# Altium schematic sheet Modes.SchDoc
size A3; SheetNumber: 2; SheetTotal: 6
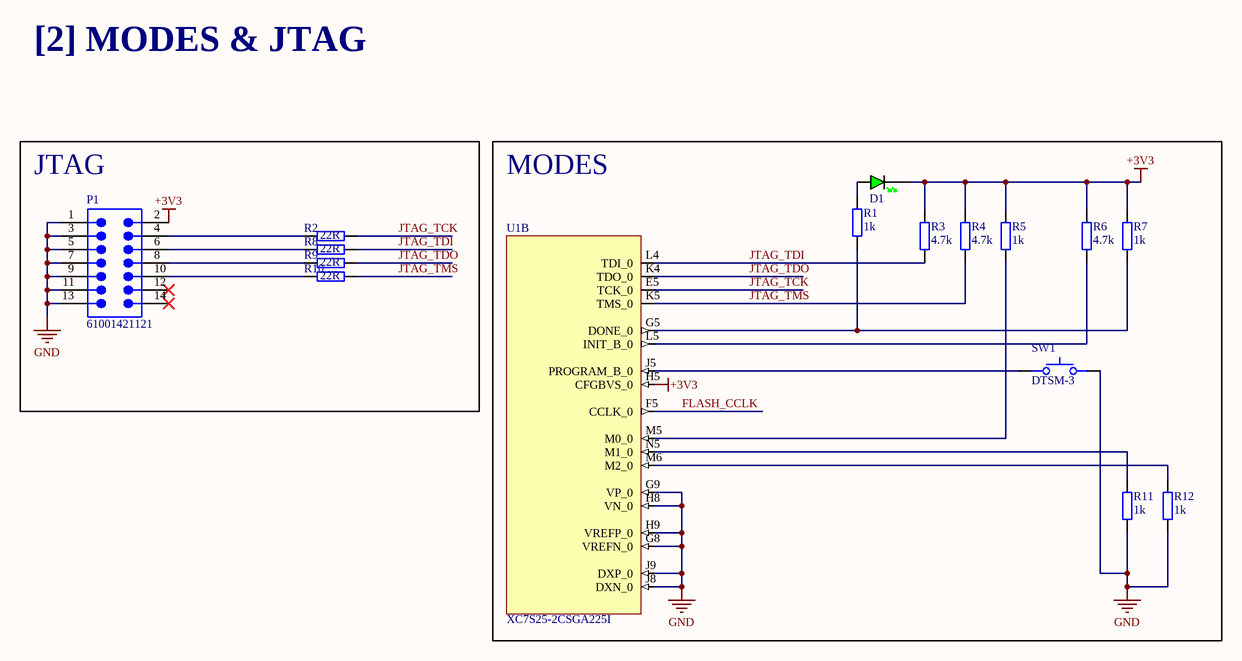
[diagram p0: Modes.SchDoc]

## Parts
D1  GREEN  [LED_0402_GREEN]  (value not drawn)
P1  61001421121  [61001421121]
R1  1k  [RES_0402]
R2  22R  [RES_0402]
R3  4.7k  [RES_0402]
R4  4.7k  [RES_0402]
R5  1k  [RES_0201]
R6  4.7k  [RES_0402]
R7  1k  [RES_0402]
R8  22R  [RES_0402]
R9  22R  [RES_0402]
R10  22R  [RES_0402]
R11  1k  [RES_0201]
R12  1k  [RES_0201]
SW1  DTSM-3  [DTSM-3]
U1  XC7S25-2CSGA225I  [CSGA225]  (part B of 5)

## Blocks framed on the sheet
JTAG: P1 R2 R8-R10
MODES: D1 R1 R3-R7 R11 R12 SW1 U1

## Nets
+3V3: D1.K P1.2 R3.2 R4.2 R5.2 R6.2 R7.2 U1.H5(CFGBVS_0)
GND: P1.1 P1.3 P1.5 P1.7 P1.9 P1.11 P1.13 R11.1 R12.1 SW1.1 U1.G8(VREFN_0) U1.G9(VP_0) U1.H8(VN_0) U1.H9(VREFP_0) U1.J8(DXN_0) U1.J9(DXP_0)
FLASH_CCLK: U1.F5(CCLK_0)
JTAG_TCK: R2.2 U1.E5(TCK_0)
JTAG_TDI: R3.1 R8.2 U1.L4(TDI_0)
JTAG_TDO: R9.2 U1.K4(TDO_0)
JTAG_TMS: R4.1 R10.2 U1.K5(TMS_0)
NetD1_A: D1.A R1.1
NetP1_4: P1.4 R2.1
NetP1_6: P1.6 R8.1
NetP1_8: P1.8 R9.1
NetP1_10: P1.10 R10.1
NetR1_2: R1.2 R7.1 U1.G5(DONE_0)
NetR5_1: R5.1 U1.M5(M0_0)
NetR6_1: R6.1 U1.L5(INIT_B_0)
NetR11_2: R11.2 U1.N5(M1_0)
NetR12_2: R12.2 U1.M6(M2_0)
NetSW1_2: SW1.2 U1.J5(PROGRAM_B_0)

Not connected (* = marked no-connect by the designer): P1 12* 14*

## Notes on the sheet
- [2] MODES & JTAG

## Library data of the parts
D1 = LED_0402_GREEN: LED 0402 GREEN SMD
P1 = CMP-1502-01031-3: NexarPartId: 32855434; Row Spacing: 2.54mm; Connector Type: Male Pin; Contact Resistance: 20mΩ; Operating Supply Voltage: 250V; Number of Positions: 14; Gender: Male; Current Rating: 3A; REACH SVHC: Unknown; Lead Pitch: 2.54mm; Termination: Solder; Contact Material: Copper; RoHS: Compliant; Orientation: Vertical; Contact Plating: Gold; Contact Mating Length: 5.9944mm; Number of Pins: 14; Pitch: 2.54mm; Number of Contacts: 14; Mount: Surface Mount; Number of Rows: 2; Color: Black
R1-R4 R6-R10 = RES_0402: Resistor SMD 0402; Manufacturer: *; Manufacturer Part Number: *; Distributor Link: *; LCSC: *
R5 R11 R12 = RES_0201: Resistor SMD 0201; Manufacturer: *; Manufacturer Part Number: *; Distributor Link: *; LCSC: *
SW1 = DTSM-3: Tactile Switch SMD SPST; Manufacturer: Diptronics; Manufacturer Part Number: DTSM-3
U1 = XC7S25-2CSGA225I: Field-Programmable Gate Array FPGA Spartan-7 Series CSGA-225 Speed Grade 2 Industrial Temperature Range; Manufacturer: Xilinx; Manufacturer Part Number: XC7S25-2CSGA225I; Distributor Link: https://www.lcsc.com/product-detail/Programmable-Logic-Device-CPLDs-FPGAs_XILINX-XC7S25-2CSGA225I_C1521711.html; LCSC: C1521711